# EAGLE design sonda6 (EAGLE 4.16)
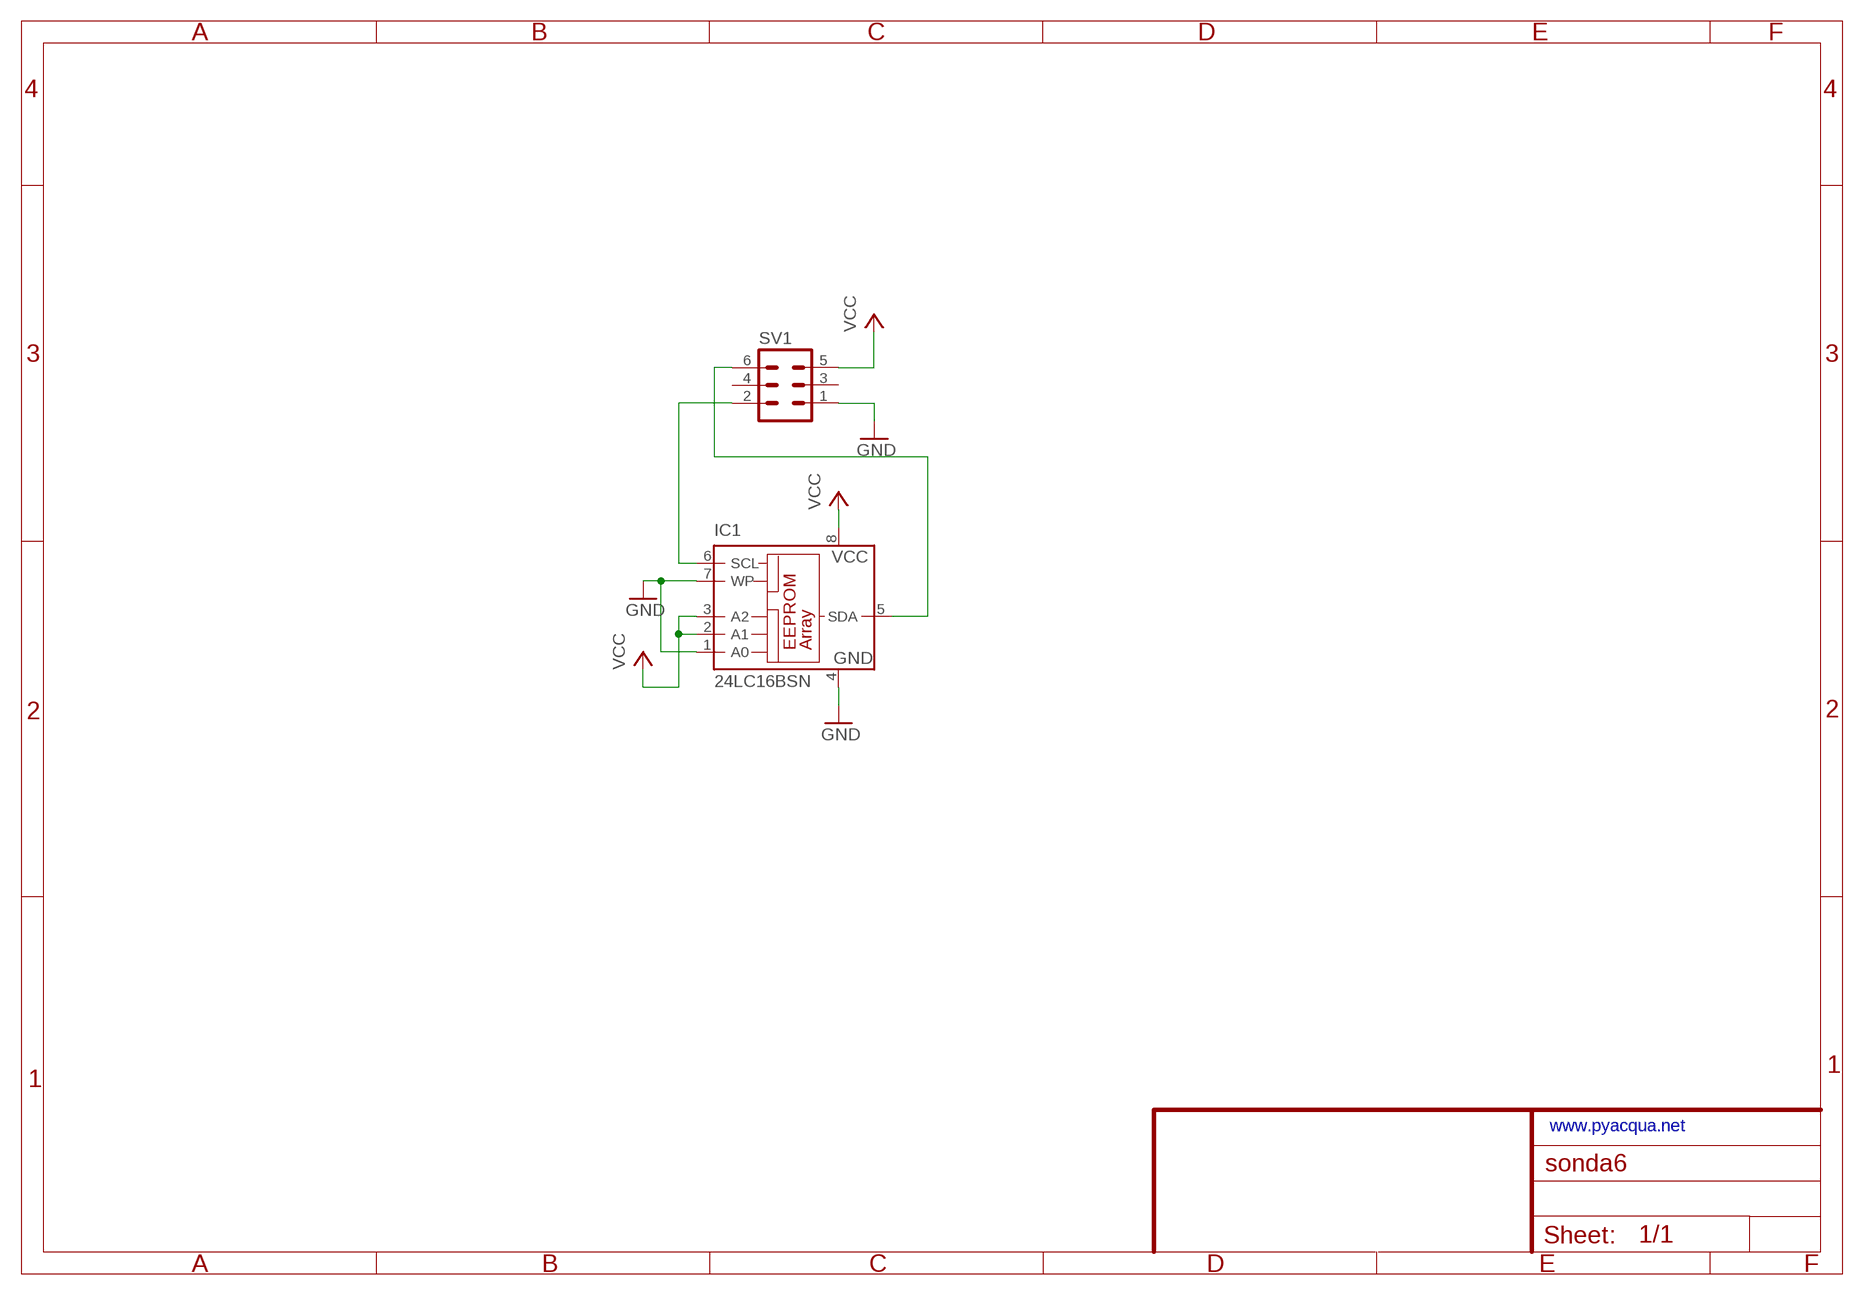
[diagram p0: schematic, sheet 1]

## Parts
IC1  24LC16BSN  [SO-08]
SV1  MA03-2  [MA03-2]

## Nets
GND: IC1.1(A0) IC1.4(GND) IC1.7(WP) SV1.1
N$1: IC1.6(SCL) SV1.2
N$2: IC1.5(SDA) SV1.6
VCC: IC1.2(A1) IC1.3(A2) IC1.8(VCC) SV1.5
Unconnected: SV1.3 SV1.4

## Notes on the sheet
- www.pyacqua.net

## Library data of the parts
IC1 = microchip:24*: Serial EEPROM I2C
SV1 = con-lstb:MA03-2: PIN HEADER

## Board
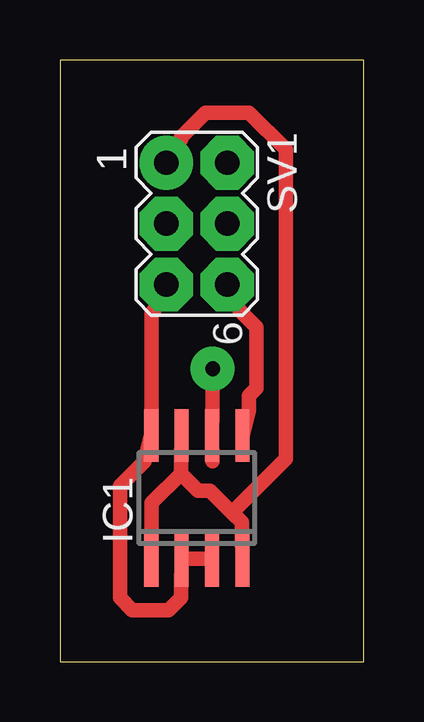
[diagram p1: board, top side]
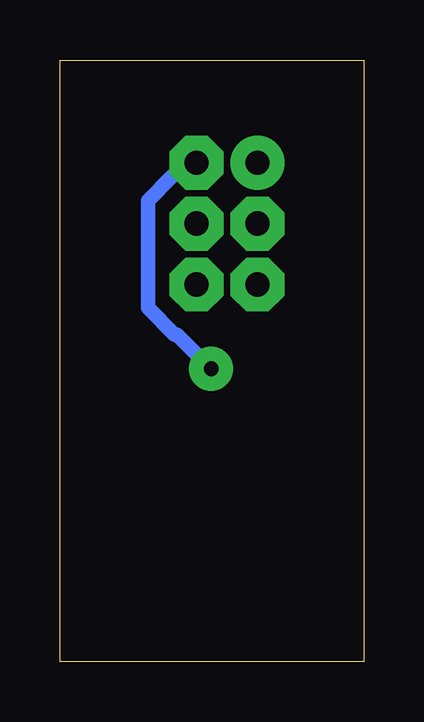
[diagram p2: board, bottom side, seen from below]

Size 12.68 x 25.07 mm. Coordinates in mm from the lower left corner, seen from the top.
Outline: 0,0 12.68,0 12.68,25.07 0,25.07 0,0
Copper layers (1*16): Top 0.035mm / dielectric 1.5mm / Bottom 0.035mm
Design rules "mio2": minimum track width 24mil, minimum drill 24mil, track to track 24mil, track to pad 24mil, pad to pad 24mil, via to via 24mil, smd to smd 24mil, copper to edge 40mil, drill to drill 8mil, minimum pad ring 24mil, minimum via ring 24mil, stop-mask expansion 4mil, vias tented up to drill 0mil, thermal gap 10mil

### Footprints (pad centres in the part's own frame; a part is rotated, then mirrored left to right if it is on the bottom)
SO-08 = smd 0.6 x 2.2: 1 -1.905,-2.6; 2 -0.635,-2.6; 3 0.635,-2.6; 4 1.905,-2.6; 5 1.905,2.6; 6 0.635,2.6; 7 -0.635,2.6; 8 -1.905,2.6
MA03-2 = drill 1.016 round: 1 -2.54,-1.27 | drill 1.016 octagon: 2 -2.54,1.27; 3 0,-1.27; 4 0,1.27; 5 2.54,-1.27; 6 2.54,1.27

### Placement (x,y rotation side)
IC1  5.71,6.82 0 top
SV1  5.71,18.25 270 top
U$1  [A4P-LOC]  -78.11,-122.72 0 top  (outside the outline)

### Tracks (layer width: path | path; a pad name or v marks a point on that pad's centre or on a via)
GND
  Top 0.61: 5.05,7.84 3.83,6.62 3.83,5.3 IC1.1 | 5.05,7.84 5.05,8.34 IC1.7 | 7.18,6.21 6.27,7.12 5.76,7.12 5.05,7.84 | 7.18,6.21 7.59,5.8 7.59,5.3 IC1.4 | SV1.1 5.05,21.75 5.05,21.86 6.07,22.87 7.89,22.87 9.42,21.35 9.42,8.45 7.18,6.21
N$1  (via drill 0.61)
  Top 0.61: 6.37,8.34 IC1.6 6.37,10.48 v6.37,12.21
  Bottom 0.61: v6.37,12.21 7.79,13.63 7.89,13.63 9.01,14.75 9.01,19.21 8,20.23 SV1.2
N$2
  Top 0.61: IC1.5 7.89,10.48 7.89,11.09 8.2,11.39 8.2,13.93 7.49,14.64 SV1.6
VCC
  Top 0.61: IC1.3 6.07,4.28 5.35,4.28 IC1.2 5.05,3.16 5.05,2.65 4.54,2.15 3.02,2.15 2.51,2.65 2.51,7.33 3.53,8.34 IC1.8 3.83,10.48 3.83,14.54 3.93,14.64 SV1.5

### Text on the board
Pads: realizarla single layer e saldare i fili sul vias anzichè sulconnettore | www.pyacqua.net